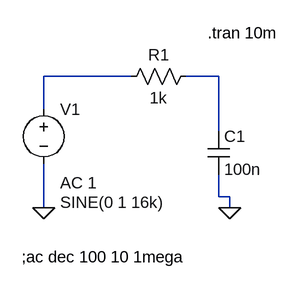
[diagram p0: schematic Draft4.asc]
Draft4.asc, the LTspice schematic file:
Version 4
SHEET 1 880 680
WIRE 16 -128 -112 -128
WIRE 144 -128 96 -128
WIRE -112 -80 -112 -128
WIRE 144 -48 144 -128
WIRE 144 48 144 16
WIRE 160 48 144 48
WIRE -112 64 -112 0
WIRE 160 64 160 48
FLAG -112 64 0
FLAG 160 64 0
SYMBOL voltage -112 -96 R0
WINDOW 3 24 152 Left 2
WINDOW 123 24 124 Left 2
WINDOW 39 0 0 Left 0
SYMATTR InstName V1
SYMATTR Value SINE(0 1 16k)
SYMATTR Value2 AC 1
SYMBOL res 112 -144 R90
WINDOW 0 0 56 VBottom 2
WINDOW 3 32 56 VTop 2
SYMATTR InstName R1
SYMATTR Value 1k
SYMBOL cap 128 -48 R0
SYMATTR InstName C1
SYMATTR Value 100n
TEXT -144 136 Left 2 !;ac dec 100 10 1mega
TEXT 128 -192 Left 2 !.tran 10m

The netlist it stands for:
* Draft4.asc
V1 N001 0 SINE(0 1 16k) AC 1
R1 N002 N001 1k
C1 N002 0 100n
;ac dec 100 10 1mega
.tran 10m
.backanno
.end